# Altium schematic sheet boot.SCHDOC
size B
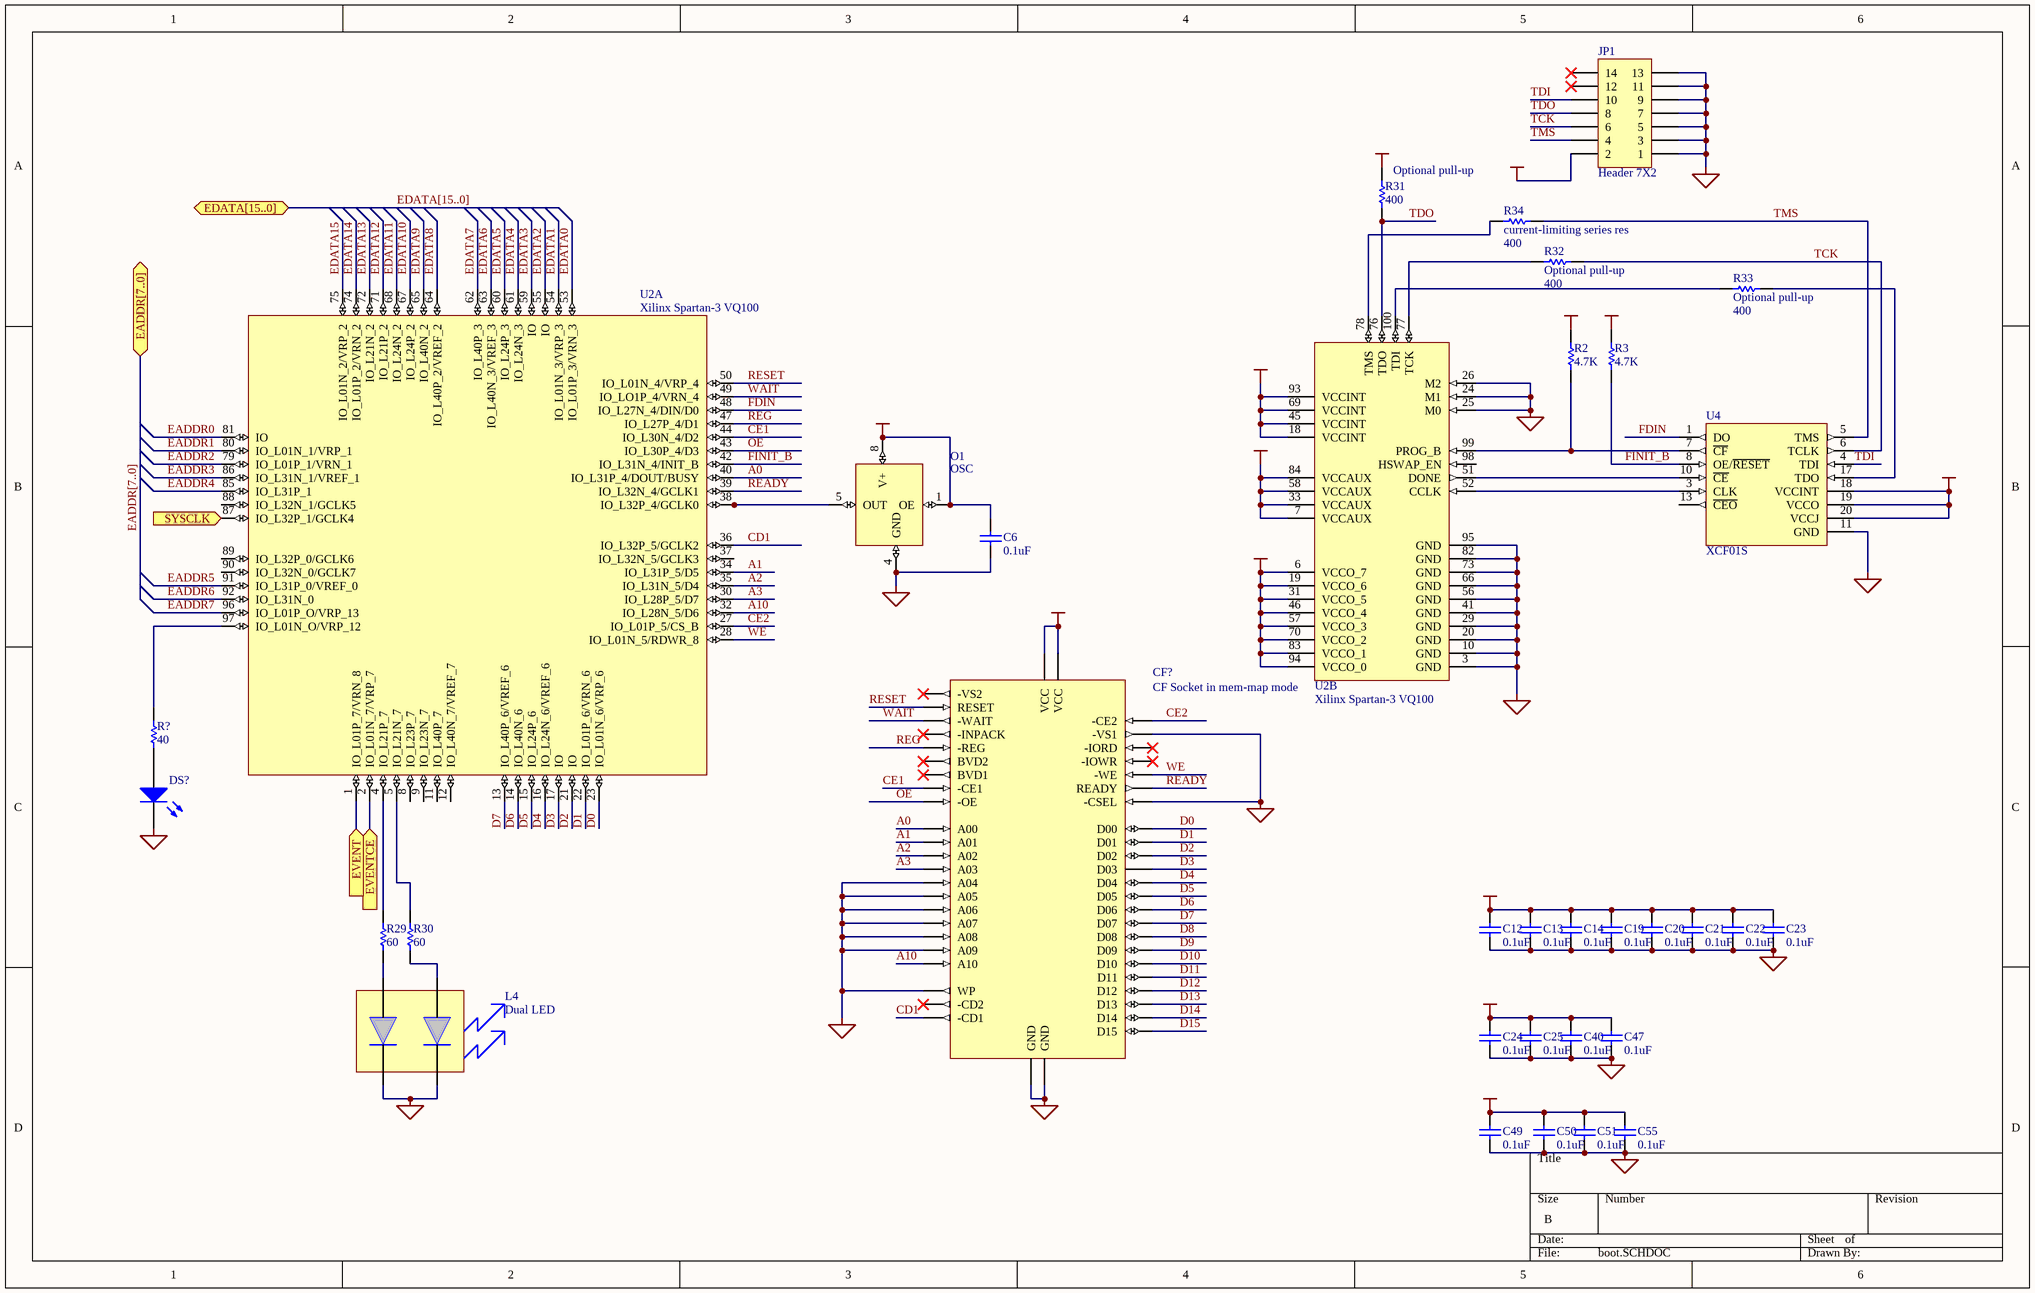
[diagram p0: boot.SCHDOC]

## Parts
C6  value 0.1uF  [CC1608-0603]  (hidden comment: Cap)
C12  value 0.1uF  [CC1608-0603]  (hidden comment: Cap)
C13  value 0.1uF  [CC1608-0603]  (hidden comment: Cap)
C14  value 0.1uF  [CC1608-0603]  (hidden comment: Cap)
C19  value 0.1uF  [CC1608-0603]  (hidden comment: Cap)
C20  value 0.1uF  [CC1608-0603]  (hidden comment: Cap)
C21  value 0.1uF  [CC1608-0603]  (hidden comment: Cap)
C22  value 0.1uF  [CC1608-0603]  (hidden comment: Cap)
C23  value 0.1uF  [CC1608-0603]  (hidden comment: Cap)
C24  value 0.1uF  [CC1608-0603]  (hidden comment: Cap)
C25  value 0.1uF  [CC1608-0603]  (hidden comment: Cap)
C40  value 0.1uF  [CC1608-0603]  (hidden comment: Cap)
C47  value 0.1uF  [CC1608-0603]  (hidden comment: Cap)
C49  value 0.1uF  [CC1608-0603]  (hidden comment: Cap)
C50  value 0.1uF  [CC1608-0603]  (hidden comment: Cap)
C51  value 0.1uF  [CC1608-0603]  (hidden comment: Cap)
C55  value 0.1uF  [CC1608-0603]  (hidden comment: Cap)
CF?  CF Socket in mem-map mode
DS?  LED0  [T-1_LED]  (value not drawn)
JP1  Header 7X2  [HDR2X7]
L4  Dual LED  [LUMEX DUAL RT-ANG LED]
O1  OSC  [SG636PCE]
R2  value 4.7K  [CC1608-0603]  (hidden comment: Res1)
R3  value 4.7K  [CC1608-0603]  (hidden comment: Res1)
R29  value 60  [R2012-0805]  (hidden comment: Res1)
R30  value 60  [R2012-0805]  (hidden comment: Res1)
R31  Optional pull-up  value 400  [CC1608-0603]
R32  Optional pull-up  value 400  [CC1608-0603]
R33  Optional pull-up  value 400  [CC1608-0603]
R34  current-limiting series res  value 400  [CC1608-0603]
R?  value 40  [CC1608-0603]  (hidden comment: Res1)
U2  Xilinx Spartan-3 VQ100  [F-QFP14X14-G100/N]  (parts A,B of 2)
U4  XCF01S  [TSSO6x6-G20/X.3]

## Ports
EADDR[7..0] (bidir), EDATA[15..0] (bidir), EVENT (in), EVENTCE (in), SYSCLK (in)

## Nets
+1.2VCC: C24.1 C25.1 C40.1 C47.1 U2.18(VCCINT) U2.45(VCCINT) U2.69(VCCINT) U2.93(VCCINT)
+2.5VCC: C49.1 C50.1 C51.1 C55.1 U2.7(VCCAUX) U2.33(VCCAUX) U2.58(VCCAUX) U2.84(VCCAUX)
GND: C6.2 C12.2 C13.2 C14.2 C19.2 C20.2 C21.2 C22.2 C23.2 C24.2 C25.2 C40.2 C47.2 C49.2 C50.2 C51.2 C55.2 CF?.1(GND) CF?.10(A09) CF?.11(A08) CF?.12(A07) CF?.14(A06) CF?.15(A05) CF?.16(A04) CF?.24(WP) CF?.33(-VS1) CF?.39(-CSEL) CF?.50(GND) DS?.2(K) JP1.1 JP1.3 JP1.5 JP1.7 JP1.9 JP1.11 JP1.13 L4.2 L4.4(C2) O1.4(GND) U2.3(GND) U2.10(GND) U2.20(GND) U2.24(M1) U2.25(M0) U2.26(M2) U2.29(GND) U2.41(GND) U2.56(GND) U2.66(GND) U2.73(GND) U2.82(GND) U2.95(GND) U4.11(GND)
VCC: C6.1 C12.1 C13.1 C14.1 C19.1 C20.1 C21.1 C22.1 C23.1 CF?.13(VCC) CF?.38(VCC) JP1.2 O1.1(OE) O1.8(V+) R2.2 R3.2 R31.2 U2.6(VCCO_7) U2.19(VCCO_6) U2.31(VCCO_5) U2.46(VCCO_4) U2.57(VCCO_3) U2.70(VCCO_2) U2.83(VCCO_1) U2.94(VCCO_0) U4.18(VCCINT) U4.19(VCCO) U4.20(VCCJ)
A0: CF?.20(A00) U2.40(IO_L31P_4/DOUT/BUSY)
A1: CF?.19(A01) U2.34(IO_L31P_5/D5)
A2: CF?.18(A02) U2.35(IO_L31N_5/D4)
A3: CF?.17(A03) U2.30(IO_L28P_5/D7)
A10: CF?.8(A10) U2.32(IO_L28N_5/D6)
CD1: CF?.26(-CD1) U2.36(IO_L32P_5/GCLK2)
CE1: CF?.7(-CE1) U2.44(IO_L30N_4/D2)
CE2: CF?.32(-CE2) U2.27(IO_L01P_5/CS_B)
D0: CF?.21(D00) U2.23(IO_L01N_6/VRP_6)
D1: CF?.22(D01) U2.22(IO_L01P_6/VRN_6)
D2: CF?.23(D02) U2.21(IO)
D3: CF?.2(D03) U2.17(IO)
D4: CF?.3(D04) U2.16(IO_L24N_6/VREF_6)
D5: CF?.4(D05) U2.15(IO_L24P_6)
D6: CF?.5(D06) U2.14(IO_L40N_6)
D7: CF?.6(D07) U2.13(IO_L40P_6/VREF_6)
D8: CF?.47(D08)
D9: CF?.48(D09)
D10: CF?.49(D10)
D11: CF?.27(D11)
D12: CF?.28(D12)
D13: CF?.29(D13)
D14: CF?.30(D14)
D15: CF?.31(D15)
EADDR0: U2.81(IO)
EADDR1: U2.80(IO_L01N_1/VRP_1)
EADDR2: U2.79(IO_L01P_1/VRN_1)
EADDR3: U2.86(IO_L31N_1/VREF_1)
EADDR4: U2.85(IO_L31P_1)
EADDR5: U2.91(IO_L31P_0/VREF_0)
EADDR6: U2.92(IO_L31N_0)
EADDR7: U2.96(IO_L01P_O/VRP_13)
EDATA0: U2.53(IO_L01P_3/VRN_3)
EDATA1: U2.54(IO_L01N_3/VRP_3)
EDATA2: U2.55(IO)
EDATA3: U2.59(IO)
EDATA4: U2.61(IO_L24N_3)
EDATA5: U2.60(IO_L24P_3)
EDATA6: U2.63(IO_L40N_3/VREF_3)
EDATA7: U2.62(IO_L40P_3)
EDATA8: U2.64(IO_L40P_2/VREF_2)
EDATA9: U2.65(IO_L40N_2)
EDATA10: U2.67(IO_L24P_2)
EDATA11: U2.68(IO_L24N_2)
EDATA12: U2.71(IO_L21P_2)
EDATA13: U2.72(IO_L21N_2)
EDATA14: U2.74(IO_L01P_2/VRN_2)
EDATA15: U2.75(IO_L01N_2/VRP_2)
EVENT: U2.1(IO_L01P_7/VRN_8) ; port EVENT
EVENTCE: U2.2(IO_L01N_7/VRP_7) ; port EVENTCE
FDIN: U2.48(IO_L27N_4/DIN/D0) U4.1(DO)
FINIT_B: R3.1 U2.42(IO_L31N_4/INIT_B) U4.8(OE/~{RESET})
OE: CF?.9(-OE) U2.43(IO_L30P_4/D3)
READY: CF?.37(READY) U2.39(IO_L32N_4/GCLK1)
REG: CF?.44(-REG) U2.47(IO_L27P_4/D1)
RESET: CF?.41(RESET) U2.50(IO_L01N_4/VRP_4)
SYSCLK: U2.87(IO_L32P_1/GCLK4) ; port SYSCLK
TCK: JP1.6 R32.1 U4.6(TCLK)
TDI: JP1.10 U4.4(TDI)
TDO: JP1.8 R31.1 U2.76(TDO)
TMS: JP1.4 R34.1 U4.5(TMS)
WAIT: CF?.42(-WAIT) U2.49(IO_LO1P_4/VRN_4)
WE: CF?.36(-WE) U2.28(IO_L01N_5/RDWR_8)
NetDS?_1: DS?.1(A) R?.1
NetL4_1: L4.1(A1) R29.2
NetL4_3: L4.3(A2) R30.1
NetO1_5: O1.5(OUT) U2.38(IO_L32P_4/GCLK0)
NetR2_1: R2.1 U2.99(PROG_B) U4.7(~{CF})
NetR29_1: R29.1 U2.4(IO_L21P_7)
NetR30_2: R30.2 U2.5(IO_L21N_7)
NetR32_2: R32.2 U2.77(TCK)
NetR33_1: R33.1 U4.17(TDO)
NetR33_2: R33.2 U2.100(TDI)
NetR34_2: R34.2 U2.78(TMS)
NetR?_2: R?.2 U2.97(IO_L01N_O/VRP_12)
NetU2_51: U2.51(DONE) U4.10(~{CE})
NetU2_52: U2.52(CCLK) U4.3(CLK)

Not connected (* = marked no-connect by the designer): CF? 25(-CD2)* 34(-IORD)* 35(-IOWR)* 40(-VS2)* 43(-INPACK)* 45(BVD2)* 46(BVD1)*; JP1 12* 14*; U2 8(IO_L23P_7) 9(IO_L23N_7) 11(IO_L40P_7) 12(IO_L40N_7/VREF_7) 37(IO_L32N_5/GCLK3) 88(IO_L32N_1/GCLK5) 89(IO_L32P_0/GCLK6) 90(IO_L32N_0/GCLK7) 98(HSWAP_EN); U4 13(~{CEO})

## Buses and harness runs
bus EADDR[7..0] = port EADDR[7..0]
bus EDATA[15..0] = port EDATA[15..0]

## Library data of the parts
C6 C12-C14 C19-C25 C40 C47 C49-C51 C55 = Cap: Capacitor; Manufacturer: Generic Components; Class I: Passive; Published: 8-Jun-2000; Revision: July-2002: Re-released for DXP Platform.; Publisher: Altium Limited; Class II: Capacitor
CF? = CF_MEM: CF socket in memory-mapped mode
DS? = LED0: Typical INFRARED GaAs LED; Manufacturer: Generic Components; Class I: Optoelectronic; Published: 8-Jun-2000; Revision: July-2002: Re-released for DXP Platform.; Publisher: Altium Limited; Class II: LED
JP1 = Header 7X2: Header, 7-Pin, Dual row; Manufacturer: Generic Components; Class I: Connector; Revision: July-2002: Re-released for DXP Platform.; Publisher: Altium Limited
O1 = OSC: Epson CMOS/TTL Oscillator
R2 R3 R29-R34 R? = Res1: Resistor; Manufacturer: Generic Components; Class I: Passive; Published: 8-Jun-2000; Revision: July-2002: Re-released for DXP Platform.; Publisher: Altium Limited; Class II: Resistor
U2 = XC3S50-VQ100
U4 = XCF01S: Xilinx Platform Flash